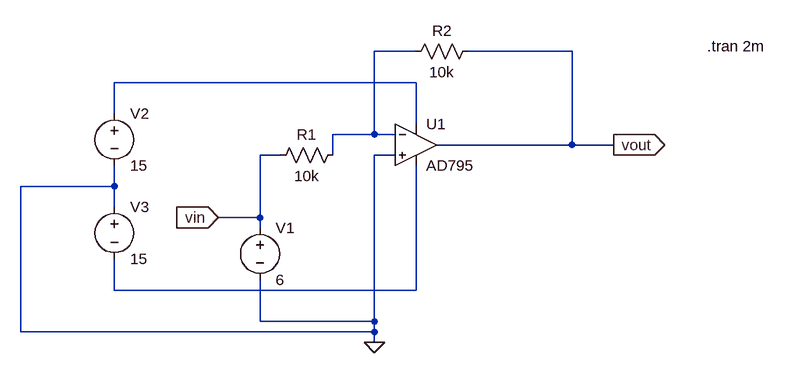
[diagram p0: schematic Draft2.asc]
Draft2.asc, the LTspice schematic file:
Version 4
SHEET 1 880 680
WIRE 176 0 112 0
WIRE 416 0 256 0
WIRE 176 48 -288 48
WIRE -288 96 -288 48
WIRE 176 112 176 48
WIRE 112 128 112 0
WIRE 112 128 48 128
WIRE 144 128 112 128
WIRE 416 144 416 0
WIRE 416 144 208 144
WIRE 480 144 416 144
WIRE -32 160 -64 160
WIRE 48 160 48 128
WIRE 144 160 112 160
WIRE -288 208 -288 176
WIRE -288 208 -432 208
WIRE -288 240 -288 208
WIRE -64 256 -64 160
WIRE -64 256 -128 256
WIRE -64 272 -64 256
WIRE -288 368 -288 320
WIRE 176 368 176 176
WIRE 176 368 -288 368
WIRE -64 416 -64 352
WIRE 112 416 112 160
WIRE 112 416 -64 416
WIRE -432 432 -432 208
WIRE 112 432 112 416
WIRE 112 432 -432 432
WIRE 112 448 112 432
FLAG 112 448 0
FLAG -128 256 vin
IOPIN -128 256 In
FLAG 480 144 vout
IOPIN 480 144 Out
SYMBOL Opamps\\AD795 176 80 R0
SYMATTR InstName U1
SYMBOL voltage -64 256 R0
WINDOW 123 0 0 Left 2
WINDOW 39 0 0 Left 2
SYMATTR InstName V1
SYMATTR Value 6
SYMBOL res 64 144 R90
WINDOW 0 0 56 VBottom 2
WINDOW 3 32 56 VTop 2
SYMATTR InstName R1
SYMATTR Value 10k
SYMBOL res 272 -16 R90
WINDOW 0 0 56 VBottom 2
WINDOW 3 32 56 VTop 2
SYMATTR InstName R2
SYMATTR Value 10k
SYMBOL voltage -288 80 R0
WINDOW 123 0 0 Left 2
WINDOW 39 0 0 Left 2
SYMATTR InstName V2
SYMATTR Value 15
SYMBOL voltage -288 224 R0
WINDOW 123 0 0 Left 2
WINDOW 39 0 0 Left 2
SYMATTR InstName V3
SYMATTR Value 15
TEXT 624 -8 Left 2 !.tran 2m

The netlist it stands for:
* Draft2.asc
XU1 0 N001 N002 N003 vout AD795  ; pins In+ In- V+ V- OUT
V1 vin 0 6
R1 N001 vin 10k
R2 vout N001 10k
V2 N002 0 15
V3 0 N003 15
.tran 2m
.lib ADI1.lib
.backanno
.end